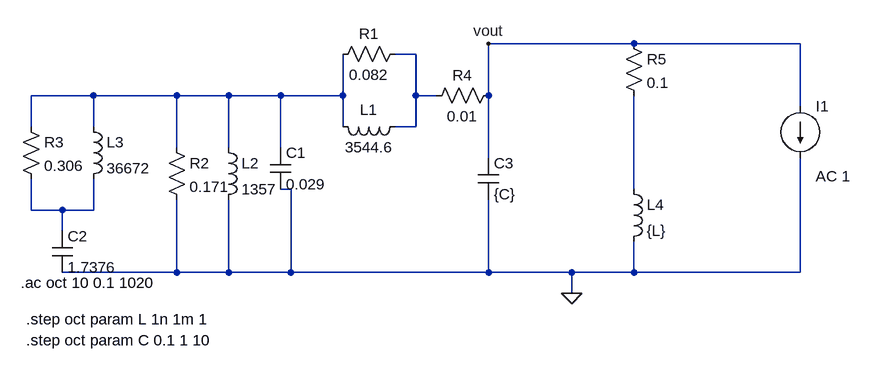
[diagram p0: schematic Draft2.asc]
Draft2.asc, the LTspice schematic file:
Version 4
SHEET 1 1000 680
WIRE 656 -80 432 -80
WIRE 912 -80 656 -80
WIRE 320 -64 288 -64
WIRE -176 0 -272 0
WIRE -48 0 -176 0
WIRE 32 0 -48 0
WIRE 112 0 32 0
WIRE 208 0 208 -64
WIRE 208 0 112 0
WIRE 320 0 320 -64
WIRE 352 0 320 0
WIRE 432 0 432 -80
WIRE 912 16 912 -80
WIRE -272 48 -272 0
WIRE -176 48 -176 0
WIRE 208 48 208 0
WIRE 320 48 320 0
WIRE 320 48 288 48
WIRE -48 80 -48 0
WIRE 32 80 32 0
WIRE 112 80 112 0
WIRE 432 96 432 0
WIRE 128 144 112 144
WIRE 656 144 656 0
WIRE -272 176 -272 128
WIRE -224 176 -272 176
WIRE -176 176 -176 128
WIRE -176 176 -224 176
WIRE -224 208 -224 176
WIRE -48 272 -48 160
WIRE -48 272 -224 272
WIRE 32 272 32 160
WIRE 32 272 -48 272
WIRE 128 272 128 144
WIRE 128 272 32 272
WIRE 432 272 432 160
WIRE 432 272 128 272
WIRE 560 272 432 272
WIRE 656 272 656 224
WIRE 656 272 560 272
WIRE 912 272 912 96
WIRE 912 272 656 272
WIRE 560 304 560 272
FLAG 560 304 0
FLAG 432 -80 vout
SYMBOL res 304 -80 R90
WINDOW 0 0 56 VBottom 2
WINDOW 3 32 56 VTop 2
SYMATTR InstName R1
SYMATTR Value 0.082
SYMBOL ind 304 32 R90
WINDOW 0 5 56 VBottom 2
WINDOW 3 32 56 VTop 2
SYMATTR InstName L1
SYMATTR Value 3544.6
SYMBOL cap 96 80 R0
SYMATTR InstName C1
SYMATTR Value 0.029
SYMBOL cap -240 208 R0
SYMATTR InstName C2
SYMATTR Value 1.7376
SYMBOL ind 16 64 R0
SYMATTR InstName L2
SYMATTR Value 1357
SYMBOL res -64 64 R0
SYMATTR InstName R2
SYMATTR Value 0.171
SYMBOL res -288 32 R0
SYMATTR InstName R3
SYMATTR Value 0.306
SYMBOL ind -192 32 R0
SYMATTR InstName L3
SYMATTR Value 36672
SYMBOL res 448 -16 R90
WINDOW 0 0 56 VBottom 2
WINDOW 3 32 56 VTop 2
SYMATTR InstName R4
SYMATTR Value 0.01
SYMBOL cap 416 96 R0
SYMATTR InstName C3
SYMATTR Value {C}
SYMBOL res 640 -96 R0
SYMATTR InstName R5
SYMATTR Value 0.1
SYMBOL ind 640 128 R0
SYMATTR InstName L4
SYMATTR Value {L}
SYMBOL current 912 16 R0
WINDOW 123 24 108 Left 2
WINDOW 39 0 0 Left 2
SYMATTR Value2 AC 1
SYMATTR InstName I1
SYMATTR Value ""
TEXT -288 288 Left 2 !.ac oct 10 0.1 1020
TEXT -280 376 Left 2 !.step oct param C 0.1 1 10
TEXT -280 344 Left 2 !.step oct param L 1n 1m 1

The netlist it stands for:
* Draft2.asc
R1 N001 N002 0.082
L1 N001 N002 3544.6
C1 N002 0 0.029
C2 N004 0 1.7376
L2 N002 0 1357
R2 N002 0 0.171
R3 N002 N004 0.306
L3 N002 N004 36672
R4 vout N001 0.01
C3 vout 0 {C}
R5 vout N003 0.1
L4 N003 0 {L}
I1 vout 0 AC 1
.ac oct 10 0.1 1020
.step oct param C 0.1 1 10
.step oct param L 1n 1m 1
.backanno
.end